# EAGLE board Board no 0R (EAGLE 9.6.2)
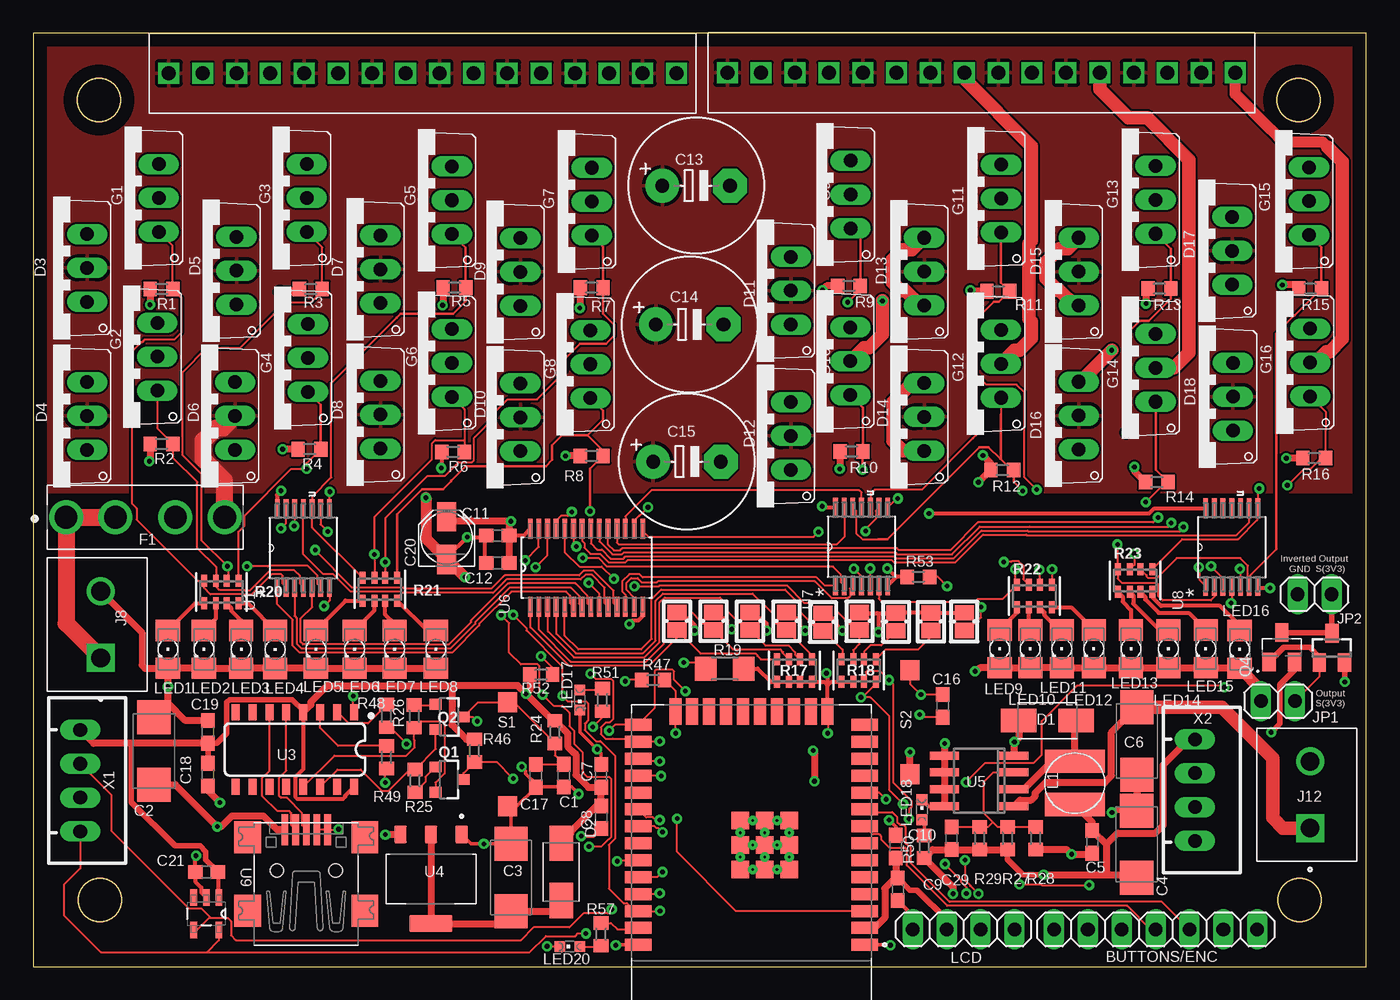
[diagram p1: board, top side]
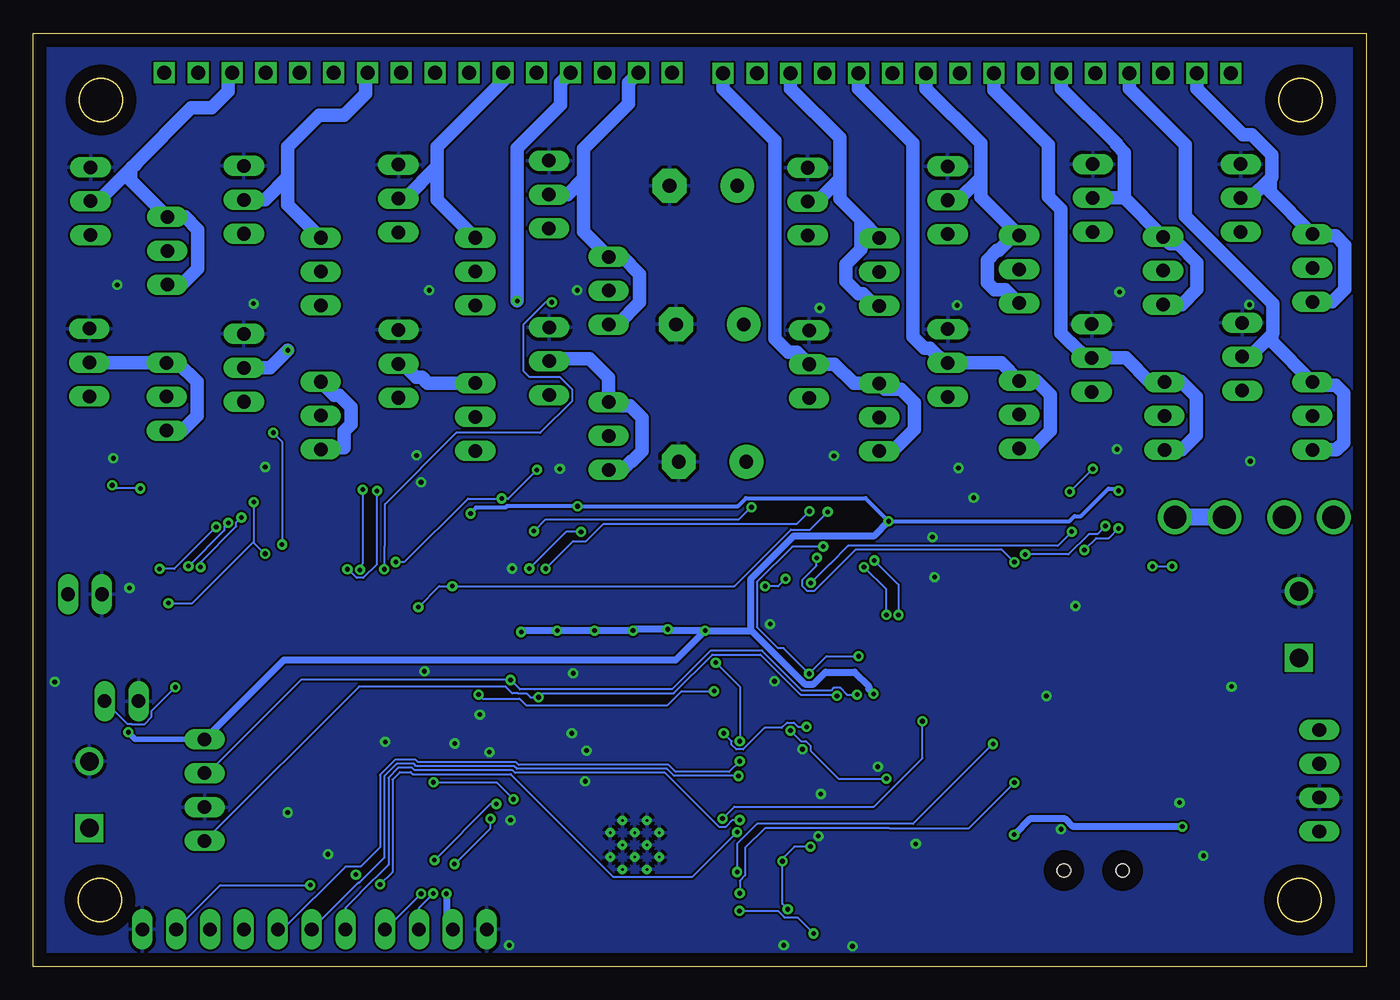
[diagram p2: board, bottom side, seen from below]

Size 100 x 70 mm. Coordinates in mm from the lower left corner, seen from the top.
Outline: 100,0 100,70 0,70 0,0 100,0
Outline: circle at 4.94,65 radius 1.62
Outline: circle at 5,5 radius 1.62
Outline: circle at 94.94,65 radius 1.62
Outline: circle at 95,5 radius 1.62
Copper layers (1*16): Top 0.035mm / dielectric 1.5mm / Bottom 0.035mm
Design rules "default": minimum track width 6mil, minimum drill 0.35mm, track to track 6mil, track to pad 6mil, pad to pad 6mil, via to via 6mil, smd to smd 6mil, copper to edge 40mil, drill to drill 6mil, minimum pad ring 10mil, minimum via ring 8mil, stop-mask expansion 4mil, vias tented up to drill 0mil, thermal gap 10mil
Net classes: 1 power: clearance 0.254 mm

## Footprints (pad centres in the part's own frame; a part is rotated, then mirrored left to right if it is on the bottom)
1X07 = drill 1.016 long: 1 -7.62,0; 2 -5.08,0; 3 -2.54,0; 4 0,0; 5 2.54,0; 6 5.08,0; 7 7.62,0
C0603 = smd 1.1 x 1: 1 -0.85,0; 2 0.85,0
C/6032-28R = smd 2.55 x 2.5: + 2.525,0; - -2.525,0
E5-10,5 = drill 1.016 pad 2.54: + -2.54,0 | drill 1.016 pad 2.54 octagon: - 2.54,0
PANASONIC_B = smd 2.2 x 1.4: + 1.6,0; - -1.6,0
USB-MINIB = smd 0.5 x 2.308: D+ 0,4.064; D- -0.8,4.064; GND 1.6,4.064; ID 0.8,4.064; VBUS -1.6,4.064 | smd 2 x 2.4: GND1 -4.4,-2; GND2 -4.4,3.5; GND3 4.4,3.5; GND4 4.4,-2 | hole 1: -2.2,1; 2.2,1
2.54-16P = drill 1.05 square: P$1 -19.05,0; P$2 -16.51,0; P$3 -13.97,0; P$4 -11.43,0; P$5 -8.89,0; P$6 -6.35,0; P$7 -3.81,0; P$8 -1.27,0; P$9 1.27,0; P$10 3.81,0; P$11 6.35,0; P$12 8.89,0; P$13 11.43,0; P$14 13.97,0; P$15 16.51,0; P$16 19.05,0
DIOM4427X270N = smd 2.65 x 1.75: A 2.15,0; C -2.15,0
TO220V = drill 1.016 long: 1 -2.54,-2.54; 2 0,-2.54; 3 2.54,-2.54
FUSE_3544-2 = drill 1.7: 1_1 -5.95,0; 1_2 -2.25,0; 2_1 2.25,0; 2_2 5.95,0
JUMPER_SOLDER_1X2 = smd 1.143 x 1.422: 1 -0.66,0; 2 0.66,0
KF301-2P = drill 1.4 square: 1 -2.5,0 | drill 1.4: 2 2.5,0
1X02 = drill 1.016 long: 1 -1.27,0; 2 1.27,0
CD43 = smd 4.5 x 1.75: P$1 0,1.625; P$2 0,-1.625
1X04 = drill 1.016 long: 1 -3.81,0; 2 -1.27,0; 3 1.27,0; 4 3.81,0
1206 = smd 1.6 x 1.803: A -1.422,0; C 1.422,0
LED-603 = smd 0.8 x 0.8: A 0,-0.75; C 0,0.75
SOT23-3 = smd 0.8 x 0.9: 1 -0.95,-1; 2 0.95,-1; 3 0,1.1
SSOT-3 = smd 1 x 1.4: 1 -0.95,-1.1; 2 0.95,-1.1; 3 0,1.1
SOT95P240X120-3N = smd 1.4 x 1: 1 -1.1,0.95; 2 -1.1,-0.95; 3 1.1,0
R0603 = smd 1 x 1.1: 1 -0.85,0; 2 0.85,0
MICROBUILDER_RESPACK_4X0603 = smd 0.45 x 0.9: 1 -1.3,-0.85; 2 -0.4,-0.85; 3 0.4,-0.85; 4 1.3,-0.85; 5 1.3,0.85; 6 0.4,0.85; 7 -0.4,0.85; 8 -1.3,0.85
R1206 = smd 1.6 x 1.803: 1 -1.422,0; 2 1.422,0
3X6X2.5 = smd 1.5 x 1.4: P$1 -3.9,0; P$2 3.9,0
SOP65P640X120-14N = smd 1.473 x 0.356: 1 -2.921,1.956; 2 -2.921,1.295; 3 -2.921,0.66; 4 -2.921,0; 5 -2.921,-0.66; 6 -2.921,-1.295; 7 -2.921,-1.956; 8 2.921,-1.956; 9 2.921,-1.295; 10 2.921,-0.66; 11 2.921,0; 12 2.921,0.66; 13 2.921,1.295; 14 2.921,1.956
MODULE_ESP32-WROOM-32 = smd 2 x 0.9: 1 -8.5,5.26; 2 -8.5,3.99; 3 -8.5,2.72; 4 -8.5,1.45; 5 -8.5,0.18; 6 -8.5,-1.09; 7 -8.5,-2.36; 8 -8.5,-3.63; 9 -8.5,-4.9; 10 -8.5,-6.17; 11 -8.5,-7.44; 12 -8.5,-8.71; 13 -8.5,-9.98; 14 -8.5,-11.25; 25 8.5,-11.25; 26 8.5,-9.98; 27 8.5,-8.71; 28 8.5,-7.44; 29 8.5,-6.17; 30 8.5,-4.9; 31 8.5,-3.63; 32 8.5,-2.36; 33 8.5,-1.09; 34 8.5,0.18; 35 8.5,1.45; 36 8.5,2.72; 37 8.5,3.99; 38 8.5,5.26 | smd 0.9 x 2: 15 -5.715,-12.25; 16 -4.445,-12.25; 17 -3.175,-12.25; 18 -1.905,-12.25; 19 -0.635,-12.25; 20 0.635,-12.25; 21 1.905,-12.25; 22 3.175,-12.25; 23 4.445,-12.25; 24 5.715,-12.25 | smd 1.33 x 1.33: 39_1 -2.835,-0.405; 39_2 -1,-0.405; 39_3 0.835,-0.405; 39_4 -2.835,-2.24; 39_5 -1,-2.24; 39_6 0.835,-2.24; 39_7 -2.835,-4.075; 39_8 -1,-4.075; 39_9 0.835,-4.075 | drill 0.2 pad 0.3: 39_10 -1.917,-0.405; 39_11 -0.083,-0.405; 39_12 -2.835,-1.323; 39_13 -1,-1.323; 39_14 0.835,-1.323; 39_15 -1.917,-2.24; 39_16 -0.083,-2.24; 39_17 -2.835,-3.158; 39_18 -1,-3.158; 39_19 0.835,-3.158; 39_20 -1.917,-4.075; 39_21 -0.083,-4.075
SO016 = smd 0.6 x 1.2: 1 -4.445,-2.8; 2 -3.175,-2.8; 3 -1.905,-2.8; 4 -0.635,-2.8; 5 0.635,-2.8; 6 1.905,-2.8; 7 3.175,-2.8; 8 4.445,-2.8; 9 4.445,2.8; 10 3.175,2.8; 11 1.905,2.8; 12 0.635,2.8; 13 -0.635,2.8; 14 -1.905,2.8; 15 -3.175,2.8; 16 -4.445,2.8
SOT229P700X180-4N = smd 1.31 x 0.93: 1 -3.345,2.29; 2 -3.345,0; 3 -3.345,-2.29 | smd 1.31 x 3.24: 4 3.345,0
SO8 = smd 0.6 x 2.2: 1 -1.905,-2.6; 2 -0.635,-2.6; 3 0.635,-2.6; 4 1.905,-2.6; 5 1.905,2.6; 6 0.635,2.6; 7 -0.635,2.6; 8 -1.905,2.6
SOP65P640X110-28N = smd 1.473 x 0.356: 1 -2.921,4.216; 2 -2.921,3.581; 3 -2.921,2.921; 4 -2.921,2.286; 5 -2.921,1.626; 6 -2.921,0.965; 7 -2.921,0.33; 8 -2.921,-0.33; 9 -2.921,-0.965; 10 -2.921,-1.626; 11 -2.921,-2.286; 12 -2.921,-2.921; 13 -2.921,-3.581; 14 -2.921,-4.216; 15 2.921,-4.216; 16 2.921,-3.581; 17 2.921,-2.921; 18 2.921,-2.286; 19 2.921,-1.626; 20 2.921,-0.965; 21 2.921,-0.33; 22 2.921,0.33; 23 2.921,0.965; 24 2.921,1.626; 25 2.921,2.286; 26 2.921,2.921; 27 2.921,3.581; 28 2.921,4.216
SOT95P280X100-5N = smd 1.219 x 0.508: 1 -1.219,0.94; 2 -1.219,0; 3 -1.219,-0.94; 4 1.219,-0.94; 5 1.219,0.94
JST-XH-04-PACKAGE-LONG-PAD = drill 1.016 long: 1 -3.81,0; 2 -1.27,0; 3 1.27,0; 4 3.81,0

## Placement (x,y rotation side)
BUTTONS/ENC  [1X07]  84.2,2.8 0 top
C1  1uF  [C0603]  39.8,14.33 270 top
C2  4.7uF  [C/6032-28R]  9.06,16.18 270 top
C3  4.7uF  [C/6032-28R]  35.84,6.68 270 top
C4  100uF  [C/6032-28R]  82.78,9.18 270 top
C5  100nF  [C0603]  79.45,9.36 270 top
C6  100uF  [C/6032-28R]  82.79,16.93 90 top
C7  10uF  [C0603]  42.6,14.3 90 top
C8  100nF  [C0603]  42.6,11.2 270 top
C9  100nF  [C0603]  64.86,5.8 270 top
C10  10uF  [C0603]  64.7,9 90 top
C11  100nF  [C0603]  34.84,32.33 180 top
C12  1uF  [C0603]  34.84,30.28 180 top
C13  [E5-10,5]  49.73,58.57 0 top
C14  [E5-10,5]  49.24,48.17 0 top
C15  [E5-10,5]  49.04,37.87 0 top
C16  100nF  [C0603]  68.23,19.56 270 top
C17  100nF  [C0603]  37.7,14.3 270 top
C18  100nF  [C0603]  13.1,14.4 270 top
C19  1uF  [C0603]  13.1,17.6 90 top
C20  [PANASONIC_B]  31.01,32.14 90 top
C21  100nF  [C0603]  13,7.11 180 top
C29  33nF  [C0603]  68.89,9.63 90 top
CN1  [USB-MINIB]  20.48,6.21 0 top
CON1  [2.54-16P]  29.21,67.02 0 top
CON2  [2.54-16P]  71.12,67.03 0 top
D1  SS12  [DIOM4427X270N]  76.08,18.46 180 top
D2  SS12  [DIOM4427X270N]  39.6,7.1 270 top
D3  [TO220V]  1.5,52.4 90 top
D4  [TO220V]  1.5,41.3 90 top
D5  [TO220V]  12.7,52.2 90 top
D6  [TO220V]  12.6,41.3 90 top
D7  [TO220V]  23.5,52.3 90 top
D8  [TO220V]  23.5,41.4 90 top
D9  [TO220V]  34,52.1 90 top
D10  [TO220V]  34,41.2 90 top
D11  [TO220V]  54.3,50.7 90 top
D12  [TO220V]  54.3,39.8 90 top
D13  [TO220V]  64.3,52.13 90 top
D14  [TO220V]  64.3,41.23 90 top
D15  [TO220V]  75.9,52.13 90 top
D16  [TO220V]  75.9,41.33 90 top
D17  [TO220V]  87.41,53.69 90 top
D18  [TO220V]  87.46,42.75 90 top
F1  3544-2  [FUSE_3544-2]  8.4,33.7 0 top
G1  [TO220V]  6.87,57.65 90 top
G2  [TO220V]  6.76,45.75 90 top
G3  [TO220V]  17.97,57.65 90 top
G4  [TO220V]  18.06,45.65 90 top
G5  [TO220V]  28.87,57.48 90 top
G6  [TO220V]  28.86,45.28 90 top
G7  [TO220V]  39.37,57.38 90 top
G8  [TO220V]  39.26,45.18 90 top
G9  [TO220V]  58.77,57.91 90 top
G10  [TO220V]  58.76,45.41 90 top
G11  [TO220V]  70.07,57.61 90 top
G12  [TO220V]  70.06,45.21 90 top
G13  [TO220V]  81.67,57.51 90 top
G14  [TO220V]  81.66,44.91 90 top
G15  [TO220V]  93.17,57.41 90 top
G16  [TO220V]  93.26,45.31 90 top
J1  JUMPER_SOLDER_1X2  [JUMPER_SOLDER_1X2]  48.29,25.91 270 top
J2  JUMPER_SOLDER_1X2  [JUMPER_SOLDER_1X2]  51.03,25.91 270 top
J3  JUMPER_SOLDER_1X2  [JUMPER_SOLDER_1X2]  53.77,25.91 270 top
J4  JUMPER_SOLDER_1X2  [JUMPER_SOLDER_1X2]  56.51,25.91 270 top
J5  JUMPER_SOLDER_1X2  [JUMPER_SOLDER_1X2]  59.25,25.84 270 top
J6  JUMPER_SOLDER_1X2  [JUMPER_SOLDER_1X2]  61.99,25.91 270 top
J8  KF301-2P  [KF301-2P]  5.05,25.65 90 top
J9  JUMPER_SOLDER_1X2  [JUMPER_SOLDER_1X2]  64.73,25.86 270 top
J10  JUMPER_SOLDER_1X2  [JUMPER_SOLDER_1X2]  67.34,25.87 270 top
J11  JUMPER_SOLDER_1X2  [JUMPER_SOLDER_1X2]  69.84,25.88 270 top
J12  KF301-2P  [KF301-2P]  95.79,12.89 90 top
JP1  [1X02]  93.38,19.91 0 top
JP2  [1X02]  96.13,27.93 180 top
L1  100uH  [CD43]  78.14,13.78 0 top
LCD  [1X04]  69.8,2.8 180 top
LED1  [1206]  10.1,23.8 270 top
LED2  [1206]  12.8,23.8 270 top
LED3  [1206]  15.6,23.8 270 top
LED4  [1206]  18.14,23.79 270 top
LED5  [1206]  21.2,23.8 270 top
LED6  [1206]  24.1,23.8 270 top
LED7  [1206]  27.1,23.8 270 top
LED8  [1206]  30.2,23.8 270 top
LED9  [1206]  72.5,23.84 270 top
LED10  [1206]  74.79,23.84 270 top
LED11  [1206]  77.16,23.84 270 top
LED12  [1206]  79.56,23.84 270 top
LED13  [1206]  82.36,23.84 270 top
LED14  [1206]  85.16,23.84 270 top
LED15  [1206]  87.96,23.84 270 top
LED16  [1206]  90.5,23.8 270 top
LED17  [LED-603]  41,20 180 top
LED18  [LED-603]  66.67,11.77 0 top
LED20  [LED-603]  40.25,1.5 90 top
Q1  500mA/300V  [SOT23-3]  31.17,14.03 270 top
Q2  500mA/300V  [SOT23-3]  31.19,18.73 270 top
Q3  FDN337N  [SSOT-3]  97.43,23.9 0 top
Q4  FDN340P  [SOT95P240X120-3N]  93.67,23.95 90 top
R1  [R0603]  9.62,50.82 0 top
R2  [R0603]  9.62,39.21 0 top
R3  [R0603]  20.82,50.82 0 top
R4  [R0603]  20.72,38.81 0 top
R5  [R0603]  31.59,50.92 0 top
R6  [R0603]  31.49,38.61 0 top
R7  [R0603]  41.89,50.92 0 top
R8  [R0603]  41.89,38.31 0 top
R9  [R0603]  61.19,51.05 0 top
R10  [R0603]  61.39,38.64 0 top
R11  [R0603]  72.39,50.65 0 top
R12  [R0603]  72.69,37.24 0 top
R13  [R0603]  84.49,50.85 0 top
R14  [R0603]  84.29,36.34 0 top
R15  [R0603]  95.79,50.85 0 top
R16  [R0603]  96.09,38.14 0 top
R17  [MICROBUILDER_RESPACK_4X0603]  57.1,22.2 180 top
R18  [MICROBUILDER_RESPACK_4X0603]  61.92,22.2 0 top
R19  10K  [R1206]  51.88,22.36 0 top
R20  [MICROBUILDER_RESPACK_4X0603]  14.1,28.1 0 top
R21  [MICROBUILDER_RESPACK_4X0603]  26,28.3 0 top
R22  [MICROBUILDER_RESPACK_4X0603]  75.1,27.8 0 top
R23  [MICROBUILDER_RESPACK_4X0603]  82.66,28.97 0 top
R24  10K  [R0603]  39.14,17.6 90 top
R25  10K  [R0603]  28.64,13.93 270 top
R26  10K  [R0603]  28.57,18.77 90 top
R27  33K  [R0603]  73.09,9.63 270 top
R28  10K  [R0603]  75.19,9.63 90 top
R29  33K  [R0603]  70.99,9.63 270 top
R46  10K  [R0603]  33.1,16.2 90 top
R47  10K  [R0603]  46.5,21.5 0 top
R48  0R  [R0603]  26.5,18.8 270 top
R49  0R  [R0603]  26.5,15.7 270 top
R50  2K  [R0603]  66.85,8.99 270 top
R51  1K  [R0603]  42.7,20 270 top
R52  10K  [R0603]  38.1,21.9 180 top
R53  10K  [R0603]  66.4,29.23 0 top
R57  1K  [R0603]  42.59,2.42 90 top
S1  [3X6X2.5]  35.58,15.92 90 top
S2  [3X6X2.5]  65.77,18.34 90 top
U1  SN74HC04PW  [SOP65P640X120-14N]  20.26,31.4 90 top
U2  ESP32-WROOM-32  [MODULE_ESP32-WROOM-32]  53.88,6.89 180 top
U3  CH340C  [SO016]  19.62,16.28 180 top
U4  AMS1117  [SOT229P700X180-4N]  29.84,6.58 270 top
U5  [SO8]  70.96,13.93 90 top
U6  PCA9635PW  [SOP65P640X110-28N]  41.5,29.92 90 top
U7  SN74HC04PW  [SOP65P640X120-14N]  62.14,31.5 90 top
U8  SN74HC04PW  [SOP65P640X120-14N]  89.91,31.46 90 top
U9  LTC1694IS5#TRPBF  [SOT95P280X100-5N]  12.98,3.97 270 top
X1  JST-XH-04-PIN-LONG-PAD  [JST-XH-04-PACKAGE-LONG-PAD]  3.52,13.95 270 top
X2  JST-XH-04-PIN-LONG-PAD  [JST-XH-04-PACKAGE-LONG-PAD]  87.15,13.24 270 top

## Tracks (layer width: path | path; a pad name or v marks a point on that pad's centre or on a via)
+3V3  (via drill 0.35)
  Top 0.305: J1.1 48.73,26.13 49.13,26.13 49.6,25.65 v49.6,25.2 | J2.1 51.47,26.13 51.87,26.13 52.05,25.95 52.05,25.65 v52.4,25.3 | J3.1 54.22,26.13 54.61,26.13 55.01,25.72 v55.01,25.2 | J4.1 56.95,26.13 57.35,26.13 57.53,25.95 57.53,25.57 v57.9,25.2 | J5.1 59.62,26.13 60.09,26.13 60.27,25.95 60.27,25.63 v60.7,25.2 | J6.1 62.04,26.52 63.3,26.52 | 63.3,26.52 J9.1 J10.1 J11.1 | 63.3,26.52 63.4,26.42 v63.4,25.1 | U3.16 23.4,12.81 23.4,12.75 23.22,12.57 19.83,12.57 19.65,12.75 19.65,14.21 20.25,14.81 U3.4 | U6.28 36.77,32.33 C11.1 | U7.14 59.26,34.42 v59.16,34.52 v59.17,34.53 | v18.58,35.69 18.28,35.39 18.28,34.34 U1.14 | C21.1 13.85,5.26 U9.1 | v67.19,33.99 83.72,33.99 84.11,34.37 U8.14
  Top 0.406: C9.1 65.78,5.73 66.3,5.73 68.53,3.51 LCD.3 | U3.4 20.25,19.21 19.43,20.04 14.73,20.04 14.52,19.83 14.52,17.52 13.75,16.75 13.2,16.75 | v75.8,6.9 74.26,6.9 73.09,8.07 R27.2 | C19.1 13.2,16.75 | C18.1 13.1,16.65 13.2,16.75 | C21.1 12.94,8.02 12.94,8.62 12.51,9.05 10.63,9.05 7.36,12.33 7.36,16.75 | Q4.2 94.62,22.22 93.53,21.14 93.53,18.2 92.89,17.56 v92.87,17.58
  Top 0.508: C10.1 64.7,6.81 C9.1 64.67,6.65 63.89,5.87 63.89,3.66 63.13,2.9 U2.2 | U3.4 20.82,19.64 20.82,19.85 22.05,21.09 31.4,21.09 | v36.96,20.46 38.98,18.45 R24.2 40.09,17.49 40.09,16.5 40.46,16.14 40.47,16.14 40.71,15.9 40.71,14.38 41.64,13.45 C7.1 C8.1 42.26,12.05 40.32,10.11 40.32,9.97 D2.C | v36.96,20.46 36.34,21.09 31.4,21.09 | 80.49,9.17 C5.1 79.45,10.85 L1.P$2 | C19.1 7.36,16.75 4.53,16.75 X1.1 | R52.2 37.25,20.75 v36.96,20.46 | C12.1 C11.1 35.69,33.27 v35.83,33.41 31.34,33.41 C20.+ | v75.8,6.9 80.47,6.9 | 80.47,6.9 82.53,6.9 C4.+ | 80.47,6.9 80.49,6.92 80.49,9.17 | 80.49,9.17 81.34,10.02 84.2,10.02 84.77,10.6 84.77,15.13 86.69,17.05 X2.1 | v69,5.46 69,5.99 R50.2 67.49,8.78 C29.1 R29.2 R27.2 | 31.4,21.09 31.4,18.14 32.49,17.05 R46.2
  Bottom 0.305: v18.58,35.69 18.75,35.86 19.34,35.86 21.41,33.79 21.88,33.79 22.26,33.41 v35.83,33.41 37.56,35.14 46.54,35.14 47.15,34.53 v59.17,34.53 64.47,34.53 64.58,34.43 66.78,34.43 67.19,34.02 v67.19,33.99
  Bottom 0.406: v92.87,17.58 92.34,17.05 X2.1
  Bottom 0.508: v49.6,25.2 52.3,25.2 v52.4,25.3 54.91,25.3 v55.01,25.2 v57.9,25.2 v60.7,25.2 63.3,25.2 v63.4,25.1 | v49.6,25.2 51.81,22.98 81.22,22.98 X2.1 | v36.96,20.46 37.31,20.82 37.31,21.02 38.39,22.1 40.56,22.1 41.47,21.19 42.12,21.19 46.13,25.2 | v49.6,25.2 46.13,25.2 | 46.13,25.2 46.19,25.27 46.19,29.07 42.97,32.3 36.95,32.3 v35.83,33.41 | v69,5.46 69,3.27 LCD.3
+5V  (via drill 0.35)
  Top 0.508: v26.41,9.9 26.44,9.93 U4.3 | CN1.VBUS 18.29,10.27 17.25,11.32 14.91,11.32 14.1,10.5 v13.8,10.5 10.64,13.65 C2.+
  Bottom 0.508: v13.8,10.5 21.99,10.5 22.57,11.09 25.23,11.09 v26.41,9.9
A0
  Top 0.152: R17.4 54.58,23.05 54.33,23.3 54.33,23.36 54.2,23.49 50.05,23.49 J1.2 48.84,24.7 48.32,24.7 46.2,22.58 40.17,22.58 37.3,25.45 37.3,26.39 37.3,26.47 37.3,26.98 U6.1
A1
  Top 0.152: R17.3 56.25,23.5 56.25,23.59 56.05,23.8 52.48,23.8 J2.2 50.51,25.77 50.22,25.77 49.23,26.77 49.23,27.24 49.1,27.37 47.48,27.37 47.3,27.19 47.3,24.21 45.98,22.89 40.32,22.89 37.95,25.25 37.95,26.96 U6.2
A2
  Top 0.152: R17.2 57.15,23.4 57.15,23.59 56.65,24.1 54.92,24.1 J3.2 53.25,25.77 52.96,25.77 51.97,26.77 51.97,27.24 51.53,27.68 47.36,27.68 46.99,27.31 46.99,24.33 45.85,23.19 40.57,23.19 38.6,25.15 38.6,26.97 U6.3
A3
  Top 0.152: R17.1 58.4,23.36 J4.2 55.99,25.77 55.7,25.77 55.57,25.9 55.57,26.38 53.97,27.98 47.23,27.98 46.69,27.44 46.69,24.46 45.73,23.5 40.71,23.5 39.25,24.95 39.25,26.96 U6.4
A4
  Top 0.152: R18.8 60.72,23.15 60.72,23.78 59.4,25.1 59.33,25.1 | J5.2 59.33,25.1 | U6.5 39.87,24.83 40.9,23.8 45.6,23.8 46.39,24.59 46.39,27.57 47.1,28.29 56.4,28.29 57.45,27.24 57.45,26.7 59.05,25.1 59.33,25.1
A5  (via drill 0.35)
  Top 0.152: U6.24 39.87,31.1 40.98,30 42.63,30 v43.55,29.07 v43.56,29.08 | v45.1,28.53 46.92,28.53 46.98,28.59 56.53,28.59 57.82,27.3 60.06,27.3 60.19,27.17 60.19,26.77 61.22,25.73 61.51,25.73 J6.2 61.99,24.21 61.52,23.74 R18.7
  Bottom 0.152: v43.56,29.08 44.11,28.53 v45.1,28.53
A6  (via drill 0.35)
  Top 0.152: J11.2 70.36,25.74 70.65,25.74 71.11,26.2 v71.11,26.97 | v68.56,28.54 67.87,29.23 R53.2 | v40.4,34.11 40.1,33.81 39.6,33.81 39.21,33.42 U6.25
  Bottom 0.152: v71.11,26.97 69.54,28.54 v68.56,28.54 47.41,28.54 43.17,32.78 41.73,32.78 v40.4,34.11
BLE_ALERT_LED
  Top 0.152: R57.2 43.34,3.27 43.82,2.79 45.27,2.79 U2.37
EN  (via drill 0.35)
  Top 0.152: U2.3 52.73,4.17 48.3,8.6 v48.3,11.1 | v33.3,18.4 32.97,18.73 Q2.3 33.38,19.82 S1.P$2 36.06,19.82 R24.1 39.14,15.84 C1.1 39.77,15.15 C17.1
  Bottom 0.152: v33.3,18.4 v33.29,18.39 33.29,15.65 36.94,12 47.4,12 v48.3,11.1
ENC_A  (via drill 0.35)
  Top 0.152: v47,15.4 45.58,15.4 U2.27
  Bottom 0.152: v47,15.4 47.8,14.61 51.8,14.61 52.34,15.14 63.59,15.14 63.8,15.35 71.15,15.35 71.31,15.51 72.87,15.51 73.98,14.39 73.98,8.96 75.43,7.51 76.58,7.51 81.28,2.8 BUTTONS/ENC.3
ENC_B  (via drill 0.35)
  Top 0.152: v47.1,14.3 45.41,14.3 U2.28
  Bottom 0.152: v47.1,14.3 51.93,14.3 52.46,14.84 63.72,14.84 63.92,15.04 71.28,15.04 71.44,15.21 72.74,15.21 73.68,14.27 73.68,8.16 75.55,6.29 75.63,6.29 BUTTONS/ENC.2
ENC_BUTTON  (via drill 0.35)
  Top 0.152: U2.30 45.97,11.2 46.48,11.2 46.67,11 v47,11
  Bottom 0.152: v47,11 47.54,11 48.05,10.49 48.55,10.49 52.59,14.53 63.84,14.53 64.05,14.74 71.4,14.74 71.56,14.9 72.62,14.9 73.36,14.16 73.36,7.65 75.47,5.54 75.47,5.52 76.58,4.41 BUTTONS/ENC.1
GND  (via drill 0.35)
  Top 0.152: CN1.ID CN1.GND 22.87,10.27 v22.9,10.3 | U3.1 24,19.14 v24,20.3 | U2.15 v59.6,17.5 | U2.39_3 U2.39_14 U2.39_6 | U2.39_5 U2.39_13 U2.39_2 | U2.39_1 U2.39_12 U2.39_4 U2.39_7 | U2.39_8 U2.39_18 | U2.39_9 U2.39_19 | v44.4,21.4 44.5,21.5 R47.1 | C16.2 66.69,18.71 v66.5,18.9 | LED20.C 38.57,1.5 v38.54,1.53 | U1.7 22.22,27.46 v21.81,27.05
  Top 0.254: U2.38 43.73,1.63 v43.7,1.6 | U2.1 64.27,1.63 v64.3,1.6 | U4.1 32.85,9.21 v33.8,9.21 C3.- 35.84,11.76 S1.P$1 36.27,12.02 C17.2 | C8.2 42.04,9.79 v41.11,9.79 | v64.2,10.99 64.7,10.49 C10.2 | C17.2 37.73,13.48 C1.2 40.39,13.48 v40.92,12.95 | LED17.C 41.02,19.23 41.02,17.58 v42.3,16.3 42.6,16 C7.2 | v36.64,14.99 36.92,14.71 36.92,14.48 37.7,13.71 C17.2
  Top 0.305: R6.1 30.64,37.44 v30.6,37.4 | R18.2 R18.1 59.84,21.35 59.59,21.1 | v59.5,22 59.59,21.91 59.59,21.1 | U2.15 59.59,21.1 | 59.59,21.1 59.34,21.35 R17.8 R17.7 R17.6 R17.5 55.35,21.35 54.34,22.36 R19.2 | LED18.C 67.17,12.03 U5.8 | C9.2 65.99,3.82 LCD.4 | U9.2 12.6,5.57 12.6,5.92 12.15,6.37 C21.2 12.15,8.26 v12.21,8.32 | U8.7 92,28.4 v92.79,28.4 | R53.1 64.75,29.23 | 64.75,29.23 U7.7 | 64.75,29.23 64.7,29.23 v64.07,29.86 | v44.72,25.69 44.99,25.96 45.38,25.96 45.72,26.29 U6.14 | 33.88,32.22 v32.55,32.22 31.06,30.73 31.06,30.54 | 33.88,32.22 C11.2 | C12.2 33.88,30.39 33.88,32.22
  Top 0.406: v80.92,11.56 81.08,11.72 C4.- | Q3.2 v98.38,21.35 v98.39,21.36
  Top 0.508: R10.1 60.54,37.46 v60.5,37.33 | v70.9,36.33 71.81,37.24 R12.1 71.84,37.76 v71.25,38.35 | R13.1 83.48,50.69 v83.48,49.73 | R15.1 94.66,51.13 v93.7,51.13 | R16.1 v94.01,38.14 v94,38.13 | R11.1 70.38,50.65 v70.3,50.73 | R8.1 v39.93,38.31 | R7.1 41,50.88 v41,49.4 | v30.7,49.6 30.74,49.64 R5.1 | R4.1 v18.71,38.81 v18.7,38.8 | R2.1 8.77,37.97 v8.7,37.9 | LED1.C v10.1,21 10.1,19.75 | LED2.C LED1.C | LED2.C 13.02,22.38 13.3,22.1 13.08,22.1 LED2.C | LED5.C 21.19,22.37 LED4.C 15.61,22.37 LED3.C LED2.C | LED5.C 21.32,22.38 21.6,22.1 21.48,22.1 LED5.C | LED5.C LED6.C LED7.C 30.12,22.38 30.5,22 | LED16.C 87.12,22.38 87.08,22.42 LED15.C LED14.C LED13.C LED12.C LED11.C LED10.C LED9.C 71.02,22.42 70.71,22.11 70.69,22.11 v70.65,22.15 | R1.1 8.76,50.81 v8.76,49.64 | R9.1 59.52,51.05 v59.2,50.73 | R28.1 77.54,8.78 v77.89,8.43 77.84,8.38 79.31,8.38 C5.2 | U5.4 73.56,16.81 v73.6,16.85 | U5.8 U5.7 U5.6 U5.5 68.36,16.72 v68.38,16.74 | C6.- C4.- | v58.5,16.2 58.6,16.1 v58.6,13.9 | S2.P$1 v65.77,16.08 v65.78,16.09 | C2.- 10.1,19.75 | C19.2 11.39,18.45 10.1,19.75 | C18.2 13.1,13.2 v14,12.3 | v73.6,16.86 v73.6,16.85 | v82.61,37.47 82.61,37.17 R14.1 | D1.A 73.93,17.18 v73.6,16.85 | J8.2 8.16,25.04 8.16,22.61 8.39,22.38 LED1.C
  Top 0.61: LED8.C 30.5,22.08 30.5,22 | R3.1 19.75,50.6 v18.5,50.6
  Top 0.813: v29.45,35.17 29.45,32.1 C20.- 31.06,30.54 v32.38,29.22 | LED16.C 92.11,20.77 JP1.1
  pour Bottom: 0,70 100,70 100,0 0,0
HOMEBTN
  Top 0.152: U2.9 62.57,11.6 64.45,11.6 64.81,11.24 64.81,10.89 65.06,10.63 65.3,10.63 65.43,10.49 65.43,9.28 65.47,9.23 65.52,9.23 65.83,8.92 65.83,7.77 68.75,4.86 84.68,4.86 BUTTONS/ENC.5
IO0  (via drill 0.35)
  Top 0.152: v43.2,17.7 43.64,18.14 U2.25 46.62,19.38 46.62,22.14 46.76,22.28 47.95,22.28 48.08,22.14 48.08,21.51 v48.92,20.67 | S2.P$2 65.77,21.23 v66.6,20.4 v66.61,20.41 C16.1 | Q1.3 32.27,14.52 R46.1 34.75,15.35 v36,14.1
  Bottom 0.152: v36,14.1 39.6,14.1 41.69,16.19 41.69,16.55 42.05,16.91 42.41,16.91 v43.2,17.7 | v66.6,20.4 66.3,20.1 63.53,20.1 63.02,19.59 52.43,19.59 51.36,20.67 v48.92,20.67
IO2  (via drill 0.35)
  Top 0.152: v41.99,17.98 42.7,18.7 R51.2 | R47.2 48.16,20.68 48.16,19.2 U2.24 48.16,17.54 v48.2,17.5
  Bottom 0.152: v41.99,17.98 42.63,17.98 42.95,18.31 43.45,18.31 43.86,17.9 45.14,17.9 46.75,16.29 47.25,16.29 47.61,16.65 47.61,16.91 v48.2,17.5
LEFTBTN  (via drill 0.35)
  Top 0.152: v47.2,10.09 46.9,10.39 46.75,10.39 46.62,10.52 U2.31 | v79.22,6.12 75.68,6.12 75.63,6.17 v73.99,6.17
  Bottom 0.152: BUTTONS/ENC.6 85.97,6.12 v79.22,6.12 | v47.2,10.09 50.58,6.71 56.45,6.71 64.17,14.43 71.53,14.43 71.69,14.6 72.49,14.6 73.06,14.03 73.06,7.1 v73.99,6.17
N$1
  Bottom 1.016: CON1.P$2 12.7,65.84 9.26,62.4 8.6,62.4 7.1,60.9 7.1,59.2 7.2,59.1 | 7.2,59.1 8.65,57.65 G1.2 | 7.2,59.1 7.2,58.1 D3.3 3.9,54.8 2.3,54.8 1.6,54.1 1.6,50.8 2.54,49.86 D3.1
N$2
  Bottom 1.016: CON1.P$4 17.78,65.84 13.58,61.64 13.58,56.28 7,49.7 7,47.5 7.1,47.4 | G2.2 8.75,45.75 7.1,47.4 | 7.1,47.4 7.1,46.9 D4.3 3.8,43.6 2.3,43.6 1.7,43 1.7,39.3 2.24,38.76 D4.1
N$3
  Bottom 1.016: D5.1 13.84,49.66 12.7,50.8 12.7,52.8 14.1,54.2 14.7,54.2 D5.3 18.15,57.65 | 18.15,57.65 G3.2 | 18.15,57.65 18.15,61.05 18.76,61.66 18.76,61.74 22.86,65.84 CON1.P$6
N$4
  Bottom 1.016: CON1.P$8 27.94,65.74 23.84,61.64 23.84,57.74 22.9,56.8 22.9,47.51 22.16,46.77 22.12,46.77 21,45.65 G4.2 18.05,45.65 16.24,43.84 D6.3 13.96,43.84 13.9,43.9 12.76,42.76 12.76,39.84 13.84,38.76 D6.1
N$5
  Bottom 1.016: CON1.P$10 33.02,65.84 28.92,61.74 28.92,59.18 | G5.2 30.62,57.48 28.92,59.18 | 28.92,59.18 28.92,57.72 D7.3 26.44,54.84 27.56,53.72 27.69,53.72 28.42,52.99 28.42,51.31 27.89,50.78 27.06,50.78 D7.1
N$6
  Bottom 1.016: D8.1 25.04,38.86 23.7,40.2 23.7,42.9 24.74,43.94 D8.3 27.38,45.28 G6.2 31.6,45.28 32.72,46.4 33.15,46.4 34,47.25 34,61.74 38.1,65.84 CON1.P$12
N$7
  Bottom 1.016: CON1.P$14 43.18,65.84 39.5,62.16 39.5,59.1 | 39.5,59.1 41.22,57.38 G7.2 | 39.5,59.1 39.5,57.6 37.9,56 | 37.9,56 D9.3 | 37.9,56 37.9,53.81 39.02,52.69 39.02,51.41 38.09,50.48 37.76,50.48 36.84,49.56 D9.1
N$8
  Bottom 1.016: CON1.P$16 48.26,65.84 44.36,61.94 44.36,47.11 43.35,46.1 42.72,46.1 G8.2 39.88,45.18 38.44,43.74 D10.3 36.1,43.3 34.9,43.3 33.91,42.31 33.91,40.31 35.55,38.66 D10.1
N$9
  Bottom 1.016: 58.71,59.12 58.71,61.36 55.35,64.72 55.35,66.29 CON2.P$2 | G9.2 59.92,57.91 58.71,59.12 | 58.71,59.12 58.71,55.11 D11.3 56.8,53.2 55.77,53.2 54.51,51.94 54.51,49.82 56.17,48.16 D11.1
N$10  (via drill 0.35)
  Top 1.016: G10.2 62.32,46.43 62.69,46.43 63.7,47.43 v63.7,49.93
  Bottom 1.016: G10.2 61.1,45.61 58.28,45.61 56.84,44.17 D12.3 56.57,42.07 55.24,42.07 54.35,41.18 54.35,38.65 55.09,37.91 55.16,37.91 55.81,37.26 D12.1 | v63.7,49.93 63.7,61.38 60.44,64.64 60.44,66.28 CON2.P$4
N$11
  Top 1.016: D13.1 66.54,49.59 65.42,50.71 65.09,50.71 64.46,51.34 64.46,53.02 65.19,53.75 65.92,53.75 D13.3
  Bottom 1.016: 69.7,60.03 72.12,57.61 G11.2 | 69.7,60.03 69.7,57.53 D13.3 | CON2.P$6 64.77,66.44 69.7,61.51 69.7,60.03
N$12
  Top 1.016: D14.1 65.24,38.69 64.5,39.43 64.5,42.33 65.8,43.63 66.7,43.63 D14.3 | G12.2 73.62,46.23 73.99,46.23 74.89,47.12 74.89,48.38 74.69,48.58 74.69,54.23 74.9,54.44 74.9,61.54 69.85,66.59 CON2.P$8
  Bottom 1.016: D14.3 70.43,43.77 70.85,44.19 71.28,44.19 72.3,45.21 G12.2
N$13
  Top 1.016: D15.3 77.62,53.85 76.99,53.85 75.96,52.82 75.96,51.64 76.89,50.71 77.02,50.71 78.14,49.59 D15.1
  Bottom 1.016: 80.9,59.23 80.9,61.5 78.55,63.85 76.67,63.85 75.07,65.45 75.07,66.89 CON2.P$10 | 80.9,59.23 82.62,57.51 G13.2 | D15.3 80.9,57.13 80.9,59.23
N$14  (via drill 0.35)
  Top 1.016: v80.9,46.23 78.54,43.87 D16.3 | G14.2 85.58,44.91 86.7,46.03 86.7,60.53 83.57,63.66 82.16,63.66 80.01,65.81 CON2.P$12
  Bottom 1.016: G14.2 82.22,44.91 v80.9,46.23 | D16.1 78.3,38.93 76.7,38.93 76.7,40.15 76.15,40.7 76.15,41.96 77.05,42.85 77.42,42.85 D16.3
N$15
  Bottom 1.016: 92.7,59.83 92.3,60.23 92.3,60.26 88.15,64.41 86.62,64.41 85.39,65.64 85.39,66.73 CON2.P$14 | 92.7,59.83 95.12,57.41 G15.2 | 92.7,59.83 92.7,58.98 D17.3 88.61,56.23 87.66,55.28 87.66,52.36 88.87,51.15 D17.1
N$16
  Top 0.813: 97.1,61.47 96.74,61.84 93.78,61.84 92.83,62.79 92.77,62.84 92.72,62.9 90.17,65.45 CON2.P$16
  Top 1.016: G16.2 96.2,45.31 97.02,46.13 97.25,46.13 98.22,47.1 98.22,60.36 97.1,61.47
  Bottom 1.016: G16.2 90.02,45.31 D18.3 89.15,45.29 87.71,43.85 87.71,41.33 88.83,40.21 D18.1
N$17
  Top 0.152: Q1.1 29.42,14.23 29.42,13.86 R25.2
N$18
  Top 0.152: R26.2 30.13,19.62 Q2.1
N$19
  Top 0.305: LED1.A 12.13,27.25 R20.1
N$20
  Top 0.305: LED2.A 13.7,26.12 R20.2
N$21
  Top 0.305: R20.3 14.87,26.88 14.87,26.67 15.6,25.94 LED3.A
N$22
  Top 0.305: R20.4 16.1,27.25 LED4.A
N$23
  Top 0.305: LED5.A 23.43,27.45 R21.1
N$24
  Top 0.305: LED6.A 25.6,26.72 R21.2
N$25
  Top 0.305: LED7.A 27.1,25.7 26.4,26.4 R21.3
N$27
  Top 0.305: R21.4 29.53,25.22 LED8.A
N$28
  Top 0.305: R22.1 73.8,26.56 LED9.A
N$29
  Top 0.305: LED10.A 74.7,25.35 R22.2
N$30
  Top 0.305: LED11.A 76.98,25.26 75.87,26.37 75.87,26.58 R22.3
N$31
  Top 0.305: R22.4 77.87,26.95 LED12.A
N$32
  Top 0.305: R23.1 81.73,27.75 81.73,27.38 82.36,26.75 LED13.A
N$33
  Top 0.305: R23.2 82.53,27.85 82.53,27.22 84.49,25.26 LED14.A
N$34
  Top 0.305: R23.3 83.43,27.75 83.43,27.54 84.43,26.54 86.68,26.54 LED15.A
N$35
  Top 0.152: Q2.2 30.19,16.33 R25.1 28.24,14.78 26.65,13.19 26.15,13.19 24.56,14.78 22.82,14.78 U3.14
N$36
  Top 0.152: Q1.2 30.17,13.81 30.87,14.51 30.87,18.27 30.73,18.41 29.06,18.41 R26.1 28.57,16.99 28.61,16.95 28.61,16.45 27.98,15.82 22.6,15.82 U3.13
N$37
  Top 0.406: JP2.1 97.4,25.03 Q3.3 97.38,25.05 Q4.3
N$38
  Top 0.152: R18.6 62.32,23.2 62.32,23.42 62.32,23.62 62.8,24.1 63.63,24.1 J9.2
N$39
  Top 0.152: CN1.D- 19.36,10.6 19.36,11.52 19.23,11.66 18.32,11.66 17.19,12.79 17.19,14.18 17.71,14.7 U3.6
N$40
  Top 0.152: CN1.D+ 20.16,10.6 20.16,11.52 19.03,12.65 18.59,12.65 18.46,12.79 18.46,14.18 18.98,14.7 U3.5
N$41
  Top 0.152: J10.2 67.45,25.09 67.45,24.86 66.4,23.8 63.97,23.8 R18.5
N$42
  Top 0.508: U4.2 U4.4 34.92,3.23 C3.+ 38.8,4.16 D2.A
N$43
  Top 0.305: LED16.A 90.5,25.59 89.03,27.06 84.61,27.06 83.96,27.71 R23.4
N$44
  Top 0.152: C29.2 R29.1 71.64,10.48 71.99,10.83 | R28.2 R27.1 72.34,10.48 71.99,10.83 | U5.3 73.53,14.53 71.99,14.53 71.29,13.83 71.29,11.53 71.99,10.83
N$46
  Top 0.152: U3.2 22.84,19.08 23.67,18.25 25.1,18.25 R48.1
N$48
  Top 0.152: R49.1 22.85,16.55 21.5,17.9 21.5,19.05 U3.3
N$50
  Top 0.152: LED20.A 42.52,1.5 R57.1
N$54
  Top 0.254: LED18.A 66.85,10.84 R50.1
N$64
  Top 0.152: LED17.A 42.6,20.75 R51.1
N$65
  Top 0.508: U5.2 74.31,13.29 76.42,15.4 L1.P$1 78.14,18.37 D1.C
N$66
  Top 0.152: U6.6 40.28,27.25 40.28,27.83 39.98,28.13 35.87,28.13 33.46,25.72 33.46,25.59 31.43,23.56 19.98,23.56 19.46,24.07 19.46,26.01 18.3,27.16 U1.1
N$67
  Top 0.152: U6.7 40.94,27.23 40.94,27.83 40.34,28.43 35.74,28.43 33.15,25.84 33.15,25.72 31.3,23.86 20.1,23.86 19.77,24.2 19.77,26.14 19.6,26.3 U1.3
N$68
  Top 0.152: U6.8 41.58,27.25 41.58,27.83 40.67,28.74 35.71,28.74 35.62,28.74 32.85,25.97 32.85,25.84 31.2,24.19 29.63,24.19 29.61,24.17 20.23,24.17 20.07,24.33 20.07,26.12 20.92,26.97 U1.5
N$69  (via drill 0.35)
  Top 0.152: U6.9 42.47,27.98 v41.67,28.78 | U1.9 21.55,33.17 v22.09,32.64 v22.09,32.63
  Bottom 0.152: v41.67,28.78 40.22,30.23 40.21,30.23 38.88,31.56 23.15,31.56 23.15,31.57 v22.09,32.63
N$70
  Top 0.152: U6.10 42.87,27.25 42.87,28.44 41.92,29.39 41.42,29.39 41.08,29.04 35.49,29.04 34.49,28.04 27.71,28.04 27.62,28.13 23.8,28.13 22.49,29.44 21.74,29.44 20.26,30.92 U1.11
N$71  (via drill 0.35)
  Top 0.152: U6.11 43.53,27.25 43.53,28.21 42.05,29.69 41.29,29.69 40.95,29.35 35.36,29.35 34.36,28.35 27.83,28.35 27.75,28.43 23.93,28.43 21.15,31.21 v21.15,31.25 | v18.58,32.87 18.96,33.26 U1.13
  Bottom 0.152: v21.15,31.25 20.26,32.14 19.31,32.14 v18.58,32.87
N$72
  Top 0.152: U7.1 59.38,28.58 58.76,29.2 45.71,29.2 45.47,29.44 44.72,29.44 44.18,28.9 44.18,28.15 44.42,27.91 U6.12
N$73
  Top 0.152: U6.13 45.08,27.68 44.49,28.27 44.49,28.78 44.84,29.13 45.35,29.13 45.65,28.83 46.79,28.83 46.85,28.89 58.63,28.89 59.91,27.61 61.12,27.61 61.25,27.75 61.25,28.35 U7.3
N$74  (via drill 0.35)
  Top 0.152: U7.5 v62.8,29.85 v62.79,29.86 | U6.15 45.72,32.66 46.15,32.23 58.54,32.23 v58.91,32.6 v58.91,32.61
  Bottom 0.152: v58.91,32.61 60.04,32.61 v62.79,29.86
N$75  (via drill 0.35)
  Top 0.152: U7.9 63.21,34.19 63.21,33.59 62.44,32.82 v62.44,32.67 | v46.12,34.46 45.47,33.81 45.44,33.81 45.08,33.44 U6.16
  Bottom 0.152: v62.44,32.67 61.56,33.55 47.06,33.55 46.15,34.46 v46.12,34.46
N$76
  Top 0.152: U7.11 62.14,35.57 61.98,35.73 46.38,35.73 44.42,33.77 U6.17
N$77
  Top 0.152: U6.18 43.79,31.79 43.89,31.69 60.3,31.69 60.89,32.28 60.89,34.38 U7.13
N$78  (via drill 0.35)
  Top 0.152: U8.1 87.52,28.97 87.52,29.97 v87.45,29.97 | v84.39,33.69 84.01,33.31 70.88,33.31 68.8,31.23 64.95,31.23 64.8,31.38 44.19,31.38 44.03,31.22 43.57,31.22 43.13,31.66 U6.19
  Bottom 0.152: v87.45,29.97 87.45,30.34 84.76,33.03 84.76,33.34 84.41,33.69 v84.39,33.69
N$79  (via drill 0.35)
  Top 0.152: v85.37,33.28 85.39,33.28 85.42,33.25 85.15,32.98 74.76,32.98 74.73,33.01 71.01,33.01 68.92,30.93 64.83,30.93 64.68,31.08 44.31,31.08 44.15,30.91 43.44,30.91 42.47,31.89 U6.20 | v88.36,30.04 89.25,29.15 U8.3
  Bottom 0.152: v85.37,33.28 85.67,32.98 85.67,32.73 v88.36,30.04
N$80  (via drill 0.35)
  Top 0.152: U6.21 41.83,31.74 42.3,31.27 42.65,31.27 43.31,30.61 44.28,30.61 44.44,30.77 64.55,30.77 64.7,30.62 69.05,30.62 71.13,32.7 74.61,32.7 74.64,32.67 86.05,32.67 86.28,32.91 v86.28,32.98 | v90.53,29.83 90.57,29.79 U8.5
  Bottom 0.152: v86.28,32.98 89.43,29.83 v90.53,29.83
N$81
  Top 0.152: U6.22 41.17,31.94 41.35,31.76 41.35,31.42 41.8,30.96 42.53,30.96 43.19,30.3 44.41,30.3 44.57,30.47 64.42,30.47 64.57,30.32 69.18,30.32 71.26,32.4 74.48,32.4 74.51,32.37 90.27,32.37 91.2,33.3 U8.9
OE  (via drill 0.35)
  Top 0.152: R19.1 50.02,22.8 v48.8,22.8 | v47,16.9 46.97,16.87 45.4,16.87 | 45.4,16.87 U2.26 | v41.79,21.97 42.19,21.58 43.34,21.58 43.48,21.45 43.48,18.55 43.23,18.31 42.95,18.31 42.59,17.95 42.59,17.45 42.95,17.09 43.45,17.09 43.46,17.1 45.17,17.1 45.4,16.87 | U6.23 40.53,31.71 v40.74,31.51 | v38.08,23.29 38.95,22.41 R52.1
  Bottom 0.152: v48.8,22.8 47,21 v47,16.9 | v40.74,31.51 43.06,31.51 45.71,28.86 45.71,25.46 44.14,23.9 43.71,23.9 v41.79,21.97 40.48,23.29 v38.08,23.29
RIGHTBTN
  Top 0.152: U2.8 62.97,9.93 63.48,9.93 63.61,9.79 63.61,9.57 64.25,8.93 65.39,8.93 65.53,8.79 65.53,7.59 68.57,4.55 82.07,4.55 83.82,2.8 BUTTONS/ENC.4
RX  (via drill 0.35)
  Top 0.152: v47.2,7.1 46.81,6.71 U2.34 | v28,16.7 26.75,17.95 R48.2
  Bottom 0.152: v47.2,7.1 47.2,9.2 45.7,10.7 34,10.7 v28,16.7
SCL  (via drill 0.35)
  Top 0.152: R18.4 63.22,21.22 62.2,20.2 v62.1,20.2 62.8,20.2 64.19,18.8 64.19,13.26 v65.26,12.2 | v36,26.38 37,25.39 37,25.22 39.68,22.55 39.68,20.34 v39.71,20.31 40.14,19.88 41.49,19.88 41.63,19.75 41.63,18.49 41.38,18.24 41.38,17.73 42.21,16.91 42.55,16.91 43.63,15.82 43.63,9.58 43.19,9.14 43.19,5.85 44.28,4.76 44.54,4.76 45.26,4.04 U2.36 v47.01,4.17 v47.02,4.18 | v69.91,8 69.91,6.49 70.31,6.09 70.31,6.07 v70.91,5.46 | v41.46,2.49 40.87,2.49 40.68,2.3 38.45,2.3 37.24,1.09 13.04,1.09 | v37.68,29.97 38.58,30.87 U6.26 | X1.4 3.52,7.38 2.28,6.14 2.28,3.87 5.07,1.09 13.04,1.09 | U9.5 13.92,1.97 13.04,1.09
  Bottom 0.152: v39.71,20.31 39.8,20.4 42.44,20.4 45.45,23.41 49.05,23.41 51.97,20.49 61.81,20.49 v62.1,20.2 62.7,20.2 62.99,20.5 63.63,20.5 63.64,20.5 64.06,20.5 64.56,21.01 75.57,21.01 X2.4 | v69.91,8 65.7,12.2 v65.26,12.2 | v47.02,4.18 44.14,4.18 43.65,3.69 42.66,3.69 v41.46,2.49 | v70.91,5.46 73.57,2.8 LCD.1 | v36,26.38 36,28.29 v37.68,29.97
SDA  (via drill 0.35)
  Top 0.152: R18.3 62.47,21.5 62.47,22.09 62.57,22.2 63.5,22.2 v64.2,21.5 64.5,21.2 64.5,13.82 65.87,12.45 65.87,11.95 65.71,11.79 v65.71,11.09 | v41.69,9 42.6,9 43.17,9.57 43.2,9.57 43.33,9.71 43.33,14.1 43.2,14.23 41.54,14.23 41.19,14.58 41.19,16.1 40.58,16.71 40.58,17.69 40.22,18.05 40.22,19.04 39.68,19.57 39.03,19.57 v38.2,20.4 37.98,20.62 37.98,22.55 37.84,22.68 36.58,22.68 35.7,23.56 35.7,25.77 v35.09,26.37 | v43.8,7.9 43.88,7.98 U2.33 | v68.4,7.7 69.6,6.5 69.6,6.37 70,5.97 v70,5.48 | v43.4,4.3 43.1,4 41.28,4 40.22,2.94 37.53,2.94 36.58,1.99 15.19,1.99 14.83,2.35 14.83,3.39 14.57,3.65 13.32,3.65 | v36.9,30.46 37.92,31.48 U6.27 | U9.4 12.28,2.75 13.18,3.65 13.32,3.65 | 13.32,3.65 12.62,4.35 11.69,4.35 5.88,10.16 5.88,12.86 X1.2
  Bottom 0.152: v41.69,9 42.9,9 43.8,8.1 v43.8,7.9 43.8,4.7 v43.4,4.3 | v35.09,26.37 35.09,26.91 35.09,26.92 35.09,28.65 v36.9,30.46 | LCD.2 71.07,4.41 v70,5.48 | v68.4,7.7 65.71,10.39 v65.71,11.09 | v38.2,20.4 38.94,20.4 39.46,20.91 39.96,20.91 40.17,20.71 42.32,20.71 45.32,23.71 49.18,23.71 52.08,20.81 62.35,20.81 62.36,20.8 63.5,20.8 v64.2,21.5 79.92,21.5 86.91,14.51 X2.2
SIG1
  Top 0.152: U1.2 18.71,28.73 18.71,29.31 18.58,29.44 17.89,29.44 16.35,27.9 15.75,27.9 15.72,27.93 13.27,27.93 12.8,28.4 R20.8 12.34,28.95 7.75,33.53 7.75,34.37 7.4,34.72 7.4,46.16 8.09,46.84 8.15,46.84 8.33,47.02 10.57,47.02 11.11,47.56 11.11,50.18 R1.2 10.45,50.84 10.45,54.07 G1.1
SIG2
  Top 0.152: U1.4 20.01,28.73 20.01,29.31 19.57,29.75 17.77,29.75 16.22,28.21 15.87,28.21 15.85,28.23 13.99,28.23 13.7,28.52 R20.7 13.7,29.99 12.3,31.39 12.3,36.35 10.47,38.18 R2.2 9.3,40.38 G2.1
SIG3  (via drill 0.35)
  Top 0.152: R20.6 14.62,29.07 14.62,29.97 v14.56,30.02 12.61,31.98 12.61,36.96 11.2,38.37 11.2,44.6 13,46.4 15.5,46.4 18.94,49.84 20.83,49.84 21.67,50.68 R3.2 21.67,53.95 G3.1 | U1.6 21.33,28.71 21.33,29.31 20.58,30.05 17.64,30.05 17.62,30.03 v16.04,30.03 v16.03,30.02
  Bottom 0.152: v16.03,30.02 v14.57,30.02 v14.56,30.02
SIG4  (via drill 0.35)
  Top 0.152: R20.5 15.4,32.62 15.85,33.08 15.85,33.82 19.36,37.33 v20.51,37.33 | U1.8 22.22,35.55 22.24,35.57 v22.24,35.62
  Top 0.178: v20.51,37.33 20.51,37.75 R4.2 21.57,42.14 G4.1
  Bottom 0.152: v22.24,35.62 v20.52,37.34 v20.51,37.33
SIG5
  Top 0.152: 22.36,43.77 22.36,36.7 20.92,35.26 U1.10 20.92,32.93 R21.8
  Top 0.178: 22.36,43.77 27.24,48.66 27.26,48.66 27.55,48.95 31.48,48.95 32.44,49.91 R5.2 32.44,53.91 G5.1
SIG6  (via drill 0.35)
  Top 0.152: R21.7 v25.59,30.92 25.59,33.74 29.91,38.06 29.91,39.26 30.15,39.49 32.34,39.49 | U1.12 19.6,33.09 v19.56,33.05 v19.57,33.05 | 32.34,39.49 32.34,40.69 32.35,40.7 32.35,41.79 G6.1 | 32.34,39.49 R6.2
  Bottom 0.152: v19.57,33.05 20.18,32.45 20.81,32.45 22.34,30.92 v25.59,30.92
SIG7  (via drill 0.35)
  Top 0.152: 39.65,44.38 37.81,42.55 35.58,42.55 34.69,41.65 34.69,41.29 33.07,39.67 33.07,37.97 32.94,37.83 31.89,37.83 30.85,36.79 29.55,36.79 26.4,33.65 v26.4,30.34 R21.6 | v41.22,30.66 42.4,30.66 43.06,30 60,30 60.59,29.41 60.59,28.83 U7.2 | R7.2
  Top 0.178: 39.65,44.38 39.93,44.67 39.93,45.64 41.01,46.72 42.98,46.72 43.56,47.3 43.56,48.14 42.75,48.95 R7.2 | G7.1 42.74,54.01 R7.2
  Bottom 0.152: v26.4,30.34 27.32,31.25 38.34,31.25 41.42,28.17 41.92,28.17 42.28,28.53 42.28,29.03 41.23,30.08 v41.23,30.65 v41.22,30.66
SIG8  (via drill 0.35)
  Top 0.152: U7.4 62.14,29.27 v61.56,29.85
  Top 0.178: 41.6,39.85 42.75,41 42.75,41.69 G8.1 | v41.77,34.15 41.77,37.34 R8.2 42.74,38.71 41.6,39.85 | R21.5 27.3,33.94 29.18,35.82 30.75,35.82 31.34,36.41 31.36,36.43 32.44,37.51 33.07,37.51 33.09,37.54 38.47,37.54 38.93,38 38.93,39.11 39.67,39.85 41.6,39.85
  Bottom 0.152: v61.56,29.85 59.49,31.92 58.52,31.92 57.23,33.21 42.71,33.21 v41.77,34.15
SIG9  (via drill 0.35)
  Top 0.152: v73.67,29.8 73.67,28.78 R22.8 72.73,27.58 70.86,27.58 70.64,27.36 63.68,27.36 63.44,27.61 U7.6
  Top 0.178: v61.1,49.83 62.04,50.77 R9.2 62.04,54.64 G9.1
  Bottom 0.152: v61.1,49.83 61.58,49.83 63.25,48.16 63.25,44.7 62.77,44.22 60.49,44.22 59.55,43.28 59.55,42.46 61.97,40.04 68.26,40.04 73.62,34.68 73.62,31.54 73.67,31.49 v73.67,29.8
SIG10  (via drill 0.35)
  Top 0.152: U7.8 64.67,35 64.83,35 64.86,35.03 v64.86,35.11 | v72.81,30.35 73.36,30.35 73.42,30.41 73.92,30.41 74.28,30.05 74.28,29.07 R22.7
  Top 0.178: G10.1 62.24,41.93 R10.2 62.22,38.62 v62.22,37.26
  Bottom 0.152: v64.86,35.11 67.39,35.11 72.15,30.35 v72.81,30.35
  Bottom 0.178: v64.86,35.11 64.37,35.11 v62.22,37.26
SIG11  (via drill 0.35)
  Top 0.152: U7.10 62.8,35.45 63.13,35.78 66.65,35.78 70.5,39.63 | v75.49,29.76 R22.6 | v75.28,35.78 74.35,36.71 74.35,43.08 73.77,43.66 71.51,43.66 70.73,44.44
  Top 0.178: G11.1 72.61,51.28 R11.2 72.45,49.86 72.07,49.86 70.73,48.52 70.73,44.44 70.73,39.86 70.5,39.63
  Bottom 0.152: v75.28,35.78 75.28,30.23 75.49,30.02 v75.49,29.76
SIG12  (via drill 0.35)
  Top 0.152: v76.44,29.81 76.4,29.77 R22.5 | U7.12 61.73,34.17 61.73,32.52 62.19,32.06 63.36,32.06 | G12.1 72.6,41.39 | R12.2
  Top 0.178: 63.36,32.06 64.08,32.06 70.99,38.97 71.67,38.97 72.56,38.08 | v74.22,35.68 73.55,36.35 73.55,37.09 | 73.55,37.09 R12.2 | 72.56,38.08 73.55,37.09 | 72.6,41.39 72.6,38.11 72.56,38.08
  Bottom 0.152: v76.44,29.81 76.4,29.81 75.74,29.15 75.24,29.15 74.22,30.17 74.22,35.33
  Bottom 0.178: 74.22,35.33 v74.22,35.68
SIG13  (via drill 0.35)
  Top 0.152: U8.2 88.61,27.75 88.35,27.48 84.73,27.48 84.41,27.8 84.41,28.66 84.27,28.81 81.65,28.81 81.36,29.1 R23.8 81.36,31.64 v81.34,31.66
  Top 0.178: G13.1 85.34,53.84 R13.2 85.34,50.09 83.7,48.45 83.02,48.45 82,47.43 v82,40.04
  Bottom 0.152: v81.34,31.66 81.34,39.38 v82,40.04
SIG14  (via drill 0.35)
  Top 0.152: U8.4 89.91,27.32 v89.86,27.27 | v82.61,30.97 82.61,30.37 82.61,30.36 82.61,30.14 82.29,29.82 R23.7
  Top 0.178: G14.1 84.2,37.28 R14.2 84.95,36.34 v83.46,34.84
  Bottom 0.152: v83.46,34.84 83.46,31.78 | v82.61,30.97 82.65,30.97 83.46,31.78 | 83.46,31.78 83.51,31.83 88.06,27.27 v89.86,27.27
SIG15
  Top 0.152: R23.6 83.51,29.37 83.51,29.27 83.64,29.14 84.28,29.14 85.78,30.65 90.57,30.65 91.14,30.08 91.14,29.18 91.14,28.61 U8.6
  Top 0.178: G15.1 96.64,53.94 R15.2 94.64,48.85 94.62,48.85 93.25,47.48 93.25,31.29 91.14,29.18
SIG16  (via drill 0.35)
  Top 0.152: R23.5 86.2,32.06 90.4,32.06 91.8,33.47 91.81,33.47 91.87,33.53 U8.8 91.87,35.76 v91.97,35.86 | v94.08,36.1 94.1,36.1 95.36,37.36 95.83,37.36 96.61,38.14 R16.2 96.94,40.22 96.95,40.23 96.95,41.62 G16.1
  Bottom 0.152: v94.08,36.1 93.88,35.9 92.01,35.9 v91.97,35.86
SOLENOIDS_ON  (via drill 0.35)
  Top 0.152: v63.98,12.55 63.47,13.06 U2.10 | v69.98,13.83 71.43,15.28 75.06,15.28 75.66,15.88 75.66,18.41 78.31,21.06 89.24,21.06 v89.35,20.95 | Q3.1 96.48,21.74 JP1.2
  Top 0.406: Q4.1 93.81,23.94 95.75,23.94 96.48,23.21 Q3.1
  Bottom 0.152: v69.98,13.83 65.26,13.83 v63.98,12.55 | v89.35,20.95 91.12,19.18 91.12,18.74 91.7,18.16 92.59,18.16 92.62,18.19 92.93,18.19 JP1.2
TX  (via drill 0.35)
  Top 0.152: v47,5.5 46.94,5.44 U2.35 | v26.4,13.8 26.4,14.75 R49.2
  Bottom 0.152: v47,5.5 47,6.44 46.59,6.85 46.59,8.9 45.1,10.39 35.8,10.39 35.77,10.39 29.8,10.39 v26.4,13.8
V+
  Top 1.27: F1.2_2 14.35,36.45 12.73,38.08 12.73,39.44 13.69,40.41 14.25,40.41 D6.2
  Bottom 1.27: F1.2_1 F1.2_2
  pour Top: 0.2,70 100,70 100,35.55 0.2,35.55
VCC
  Top 1.27: J8.1 2.45,25.75 F1.1_1 F1.1_2
VDD
  Top 0.508: U5.1 74.02,12.49 74.87,12.49 75.17,12.79 75.17,13.03 75.96,13.82 80.4,13.82 80.9,14.32 80.9,17.57 C6.+
  Top 1.016: C6.+ 89.18,19.46 93,15.64 93,11.15 93.76,10.39 J12.1

## Text on the board
tNames: Inverted Output | GND | S(3V3) | Output / S(3V3)